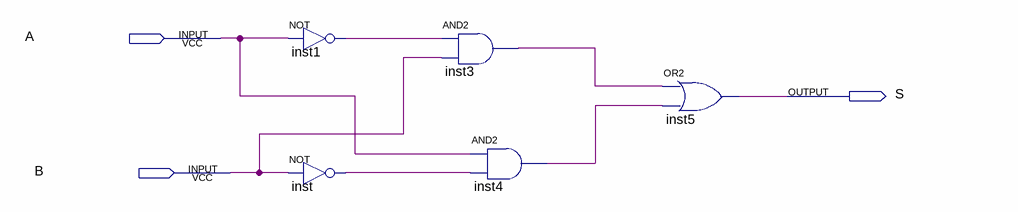
[diagram p0: schematic sheet]
// Quartus schematic expt_1.bdf as structural Verilog: 5 symbols, 3 pins
module expt_1 (
  input  A,
  input  B,
  output S
);

  wire inst1_out, inst3_out, inst4_out, inst_out;

  not inst1 (inst1_out, A);
  not inst (inst_out, B);
  and inst3 (inst3_out, inst1_out, B);
  and inst4 (inst4_out, A, inst_out);
  or inst5 (S, inst3_out, inst4_out);
endmodule
